# EAGLE design Tilt-NE555-B (EAGLE 6.4)
Circuito per prelevare gli impulsi provenienti da un tilt e creare impulsi di lunghezza determinata
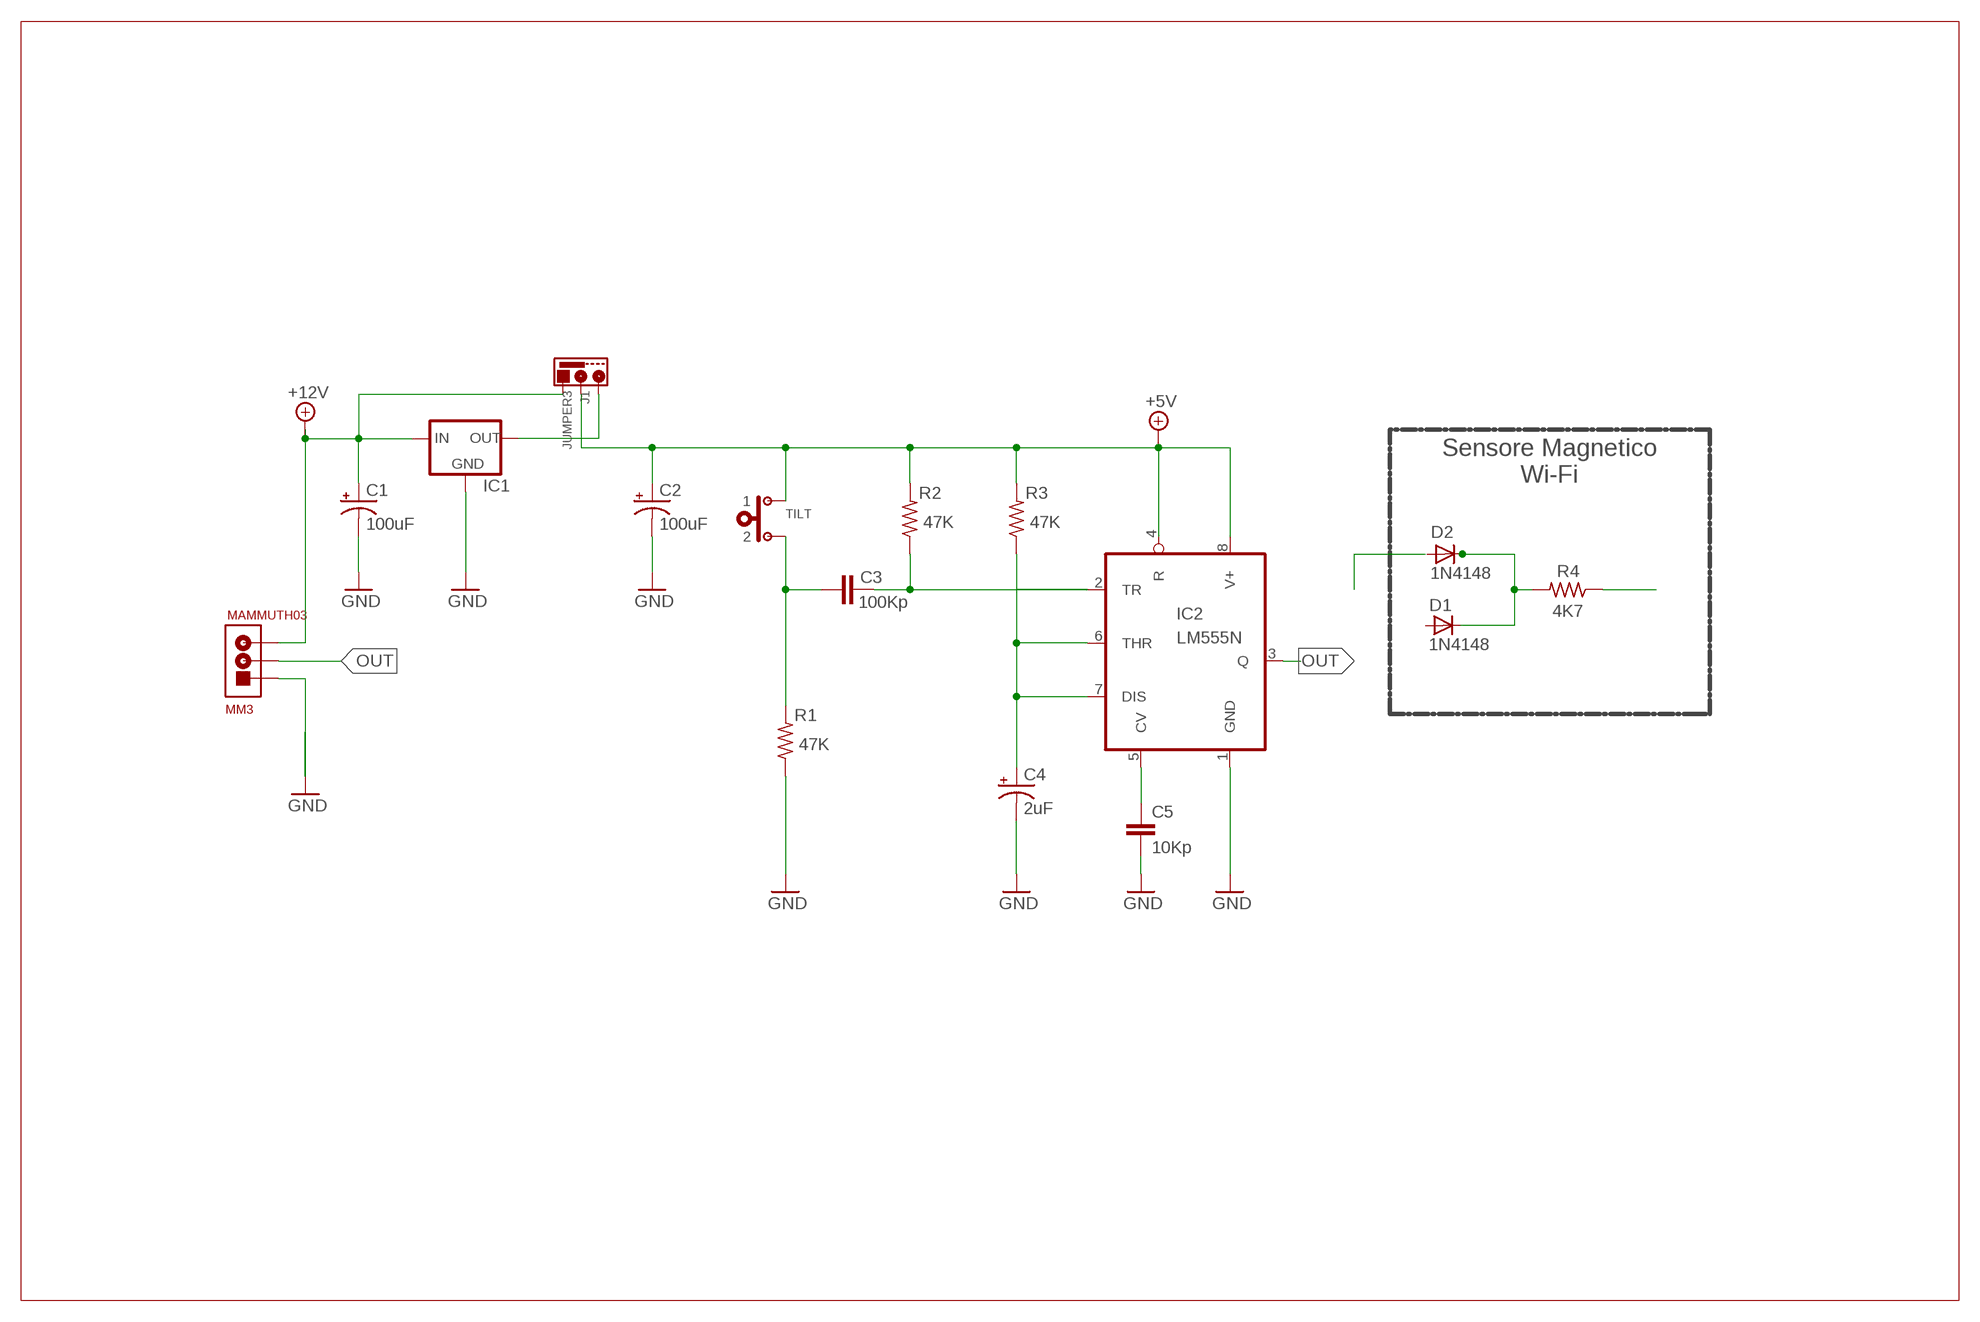
[diagram p0: schematic, sheet 1]

## Parts
C1  100uF  CPOL-US085CS-1AR  [085CS_1AR]
C2  100uF  CPOL-US085CS-1AR  [085CS_1AR]
C3  100Kp  C-EU025-025X050  [C025-025X050]
C4  2uF  CPOL-US085CS-1AR  [085CS_1AR]
C5  10Kp  C-EU025-025X050  [C025-025X050]
D1  1N4148  1N4148DO35-10  [DO35-10]
D2  1N4148  1N4148DO35-10  [DO35-10]
IC1  78LXX  [78LXX]
IC2  LM555N  [DIL08]
J1  JUMPER3  [SIP03]
MM3  MAMMUTH03  [MAMMUTH03]
R1  47K  R-US_0207/12  [0207/12]
R2  47K  R-US_0207/12  [0207/12]
R3  47K  R-US_0207/12  [0207/12]
R4  4K7  R-US_0207/12  [0207/12]
TILT  PULSANTENO  [SIP02]

## Nets
+5V: C2.+ IC2.4(R) IC2.8(V+) J1.1 R2.2 R3.2 TILT.1
+12V: C1.+ IC1.IN J1.2 MM3.P$3
GND: C1.- C2.- C4.- C5.2 IC1.GND IC2.1(GND) MM3.P$1 R1.1
N$1: C3.2 IC2.2(TR) R2.1
N$2: C3.1 R1.2 TILT.2
N$3: C4.+ IC2.6(THR) IC2.7(DIS) R3.1
N$4: C5.1 IC2.5(CV)
N$6: D1.C D2.C R4.2
N$8: IC1.OUT J1.3
OUT: IC2.3(Q) MM3.P$2
SENSORE: R4.1
Unconnected: D1.A D2.A

## Notes on the sheet
- Sensore Magnetico
  Wi-Fi

## Library data of the parts
C1 C2 C4 = Ln-RCL:CPOL-US: POLARIZED CAPACITOR, American symbol
C3 C5 = rcl:C-EU: CAPACITOR, European symbol
D1 D2 = diode:1N4148: DIODE high speed (Philips)
IC1 = Ln-v-reg:78LXX: VOLTAGE REGULATOR
IC2 = Ln-linear:*555: TIMER
J1 = Ln-Varie:JUMPER3
MM3 = Ln-Varie:MAMMUTH03: Mammuth 03
R1-R4 = rcl:R-US_: RESISTOR, American symbol
TILT = Ln-Varie:PULSANTENO: Pulsante NO

## Board
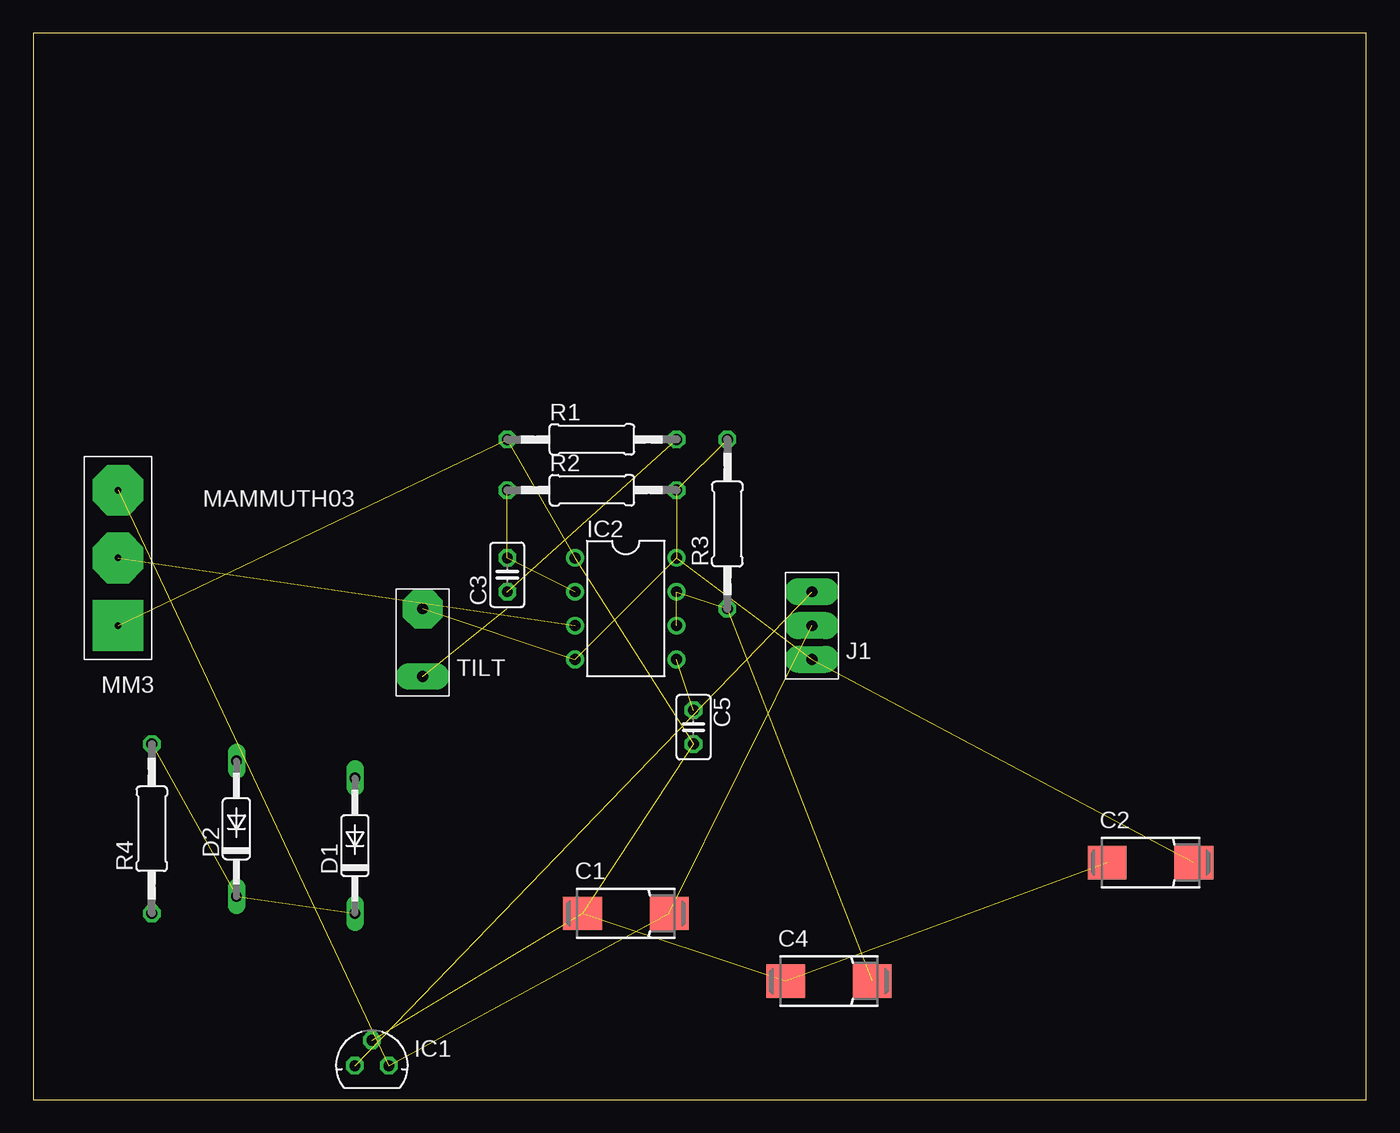
[diagram p1: board, top side]
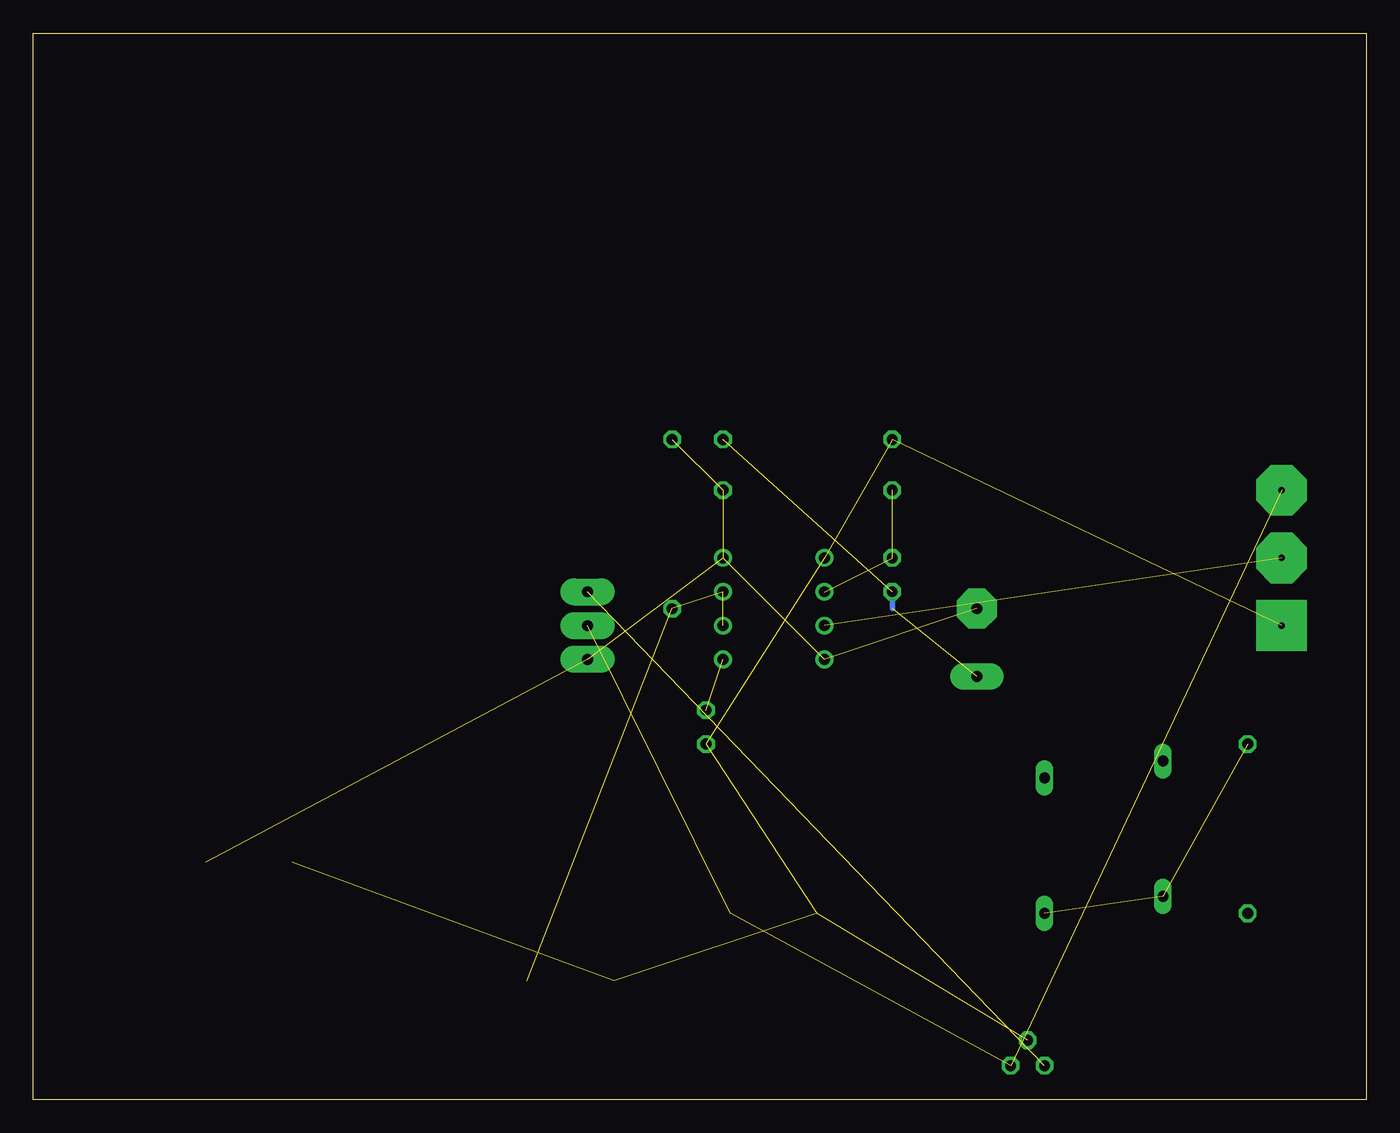
[diagram p2: board, bottom side, seen from below]

Size 100 x 80 mm. Coordinates in mm from the lower left corner, seen from the top.
Outline: 0,0 100,0 100,80 0,80 0,0
Copper layers (1*16): Top 0.035mm / dielectric 1.5mm / Bottom 0.035mm
Design rules "default": minimum track width 10mil, minimum drill 24mil, track to track 8mil, track to pad 8mil, pad to pad 8mil, via to via 8mil, smd to smd 8mil, copper to edge 40mil, drill to drill 8mil, minimum pad ring 10mil, minimum via ring 8mil, stop-mask expansion 4mil, vias tented up to drill 0mil, thermal gap 10mil

### Footprints (pad centres in the part's own frame; a part is rotated, then mirrored left to right if it is on the bottom)
085CS_1AR = smd 2.9 x 2.5: + 3.25,0; - -3.25,0
C025-025X050 = drill 0.813 octagon: 1 -1.27,0; 2 1.27,0
DO35-10 = drill 0.813 long: A 5.08,0; C -5.08,0
78LXX = drill 0.813 octagon: GND 0,1.905; IN 1.27,0; OUT -1.27,0
DIL08 = drill 0.813 pad 1.27: 1 -3.81,-3.81; 2 -1.27,-3.81; 3 1.27,-3.81; 4 3.81,-3.81; 5 3.81,3.81; 6 1.27,3.81; 7 -1.27,3.81; 8 -3.81,3.81
SIP03 = drill 0.8 pad 2.032 long: 1 0,0; 2 0,2.54; 3 0,5.08
MAMMUTH03 = drill 0.5 pad 3.81 square: P$1 0,-5.08 | drill 0.5 pad 3.81 octagon: P$2 0,0; P$3 0,5.08
0207/12 = drill 0.813 octagon: 1 -6.35,0; 2 6.35,0
SIP02 = drill 0.8 pad 3 octagon: 1 0,2.54 | drill 0.8 pad 2 long: 2 0,-2.54

### Placement (x,y rotation side)
C1  44.45,13.97 0 top
C2  83.82,17.78 0 top
C3  35.56,39.37 90 top
C4  59.69,8.89 0 top
C5  49.53,27.94 270 top
D1  24.13,19.05 90 top
D2  15.24,20.32 90 top
IC1  25.4,2.54 0 top
IC2  44.45,36.83 270 top
J1  58.42,33.02 0 top
MM3  6.35,40.64 0 top
R1  41.91,49.53 0 top
R2  41.91,45.72 0 top
R3  52.07,43.18 90 top
R4  8.89,20.32 90 top
TILT  29.21,34.29 0 top

### Tracks (layer width: path | path; a pad name or v marks a point on that pad's centre or on a via)
+5V  (6 unrouted)
+12V  (3 unrouted)
GND  (7 unrouted)
N$1  (2 unrouted)
N$2  (2 unrouted)
  Bottom 0.406: 35.56,36.83 C3.1
N$3  (3 unrouted)
N$4  (1 unrouted)
N$6  (2 unrouted)
N$8  (1 unrouted)
OUT  (1 unrouted)